# EAGLE schematic PowerSTEP01x4_002 (EAGLE 9.5.0)

## Sheet 1 of 3
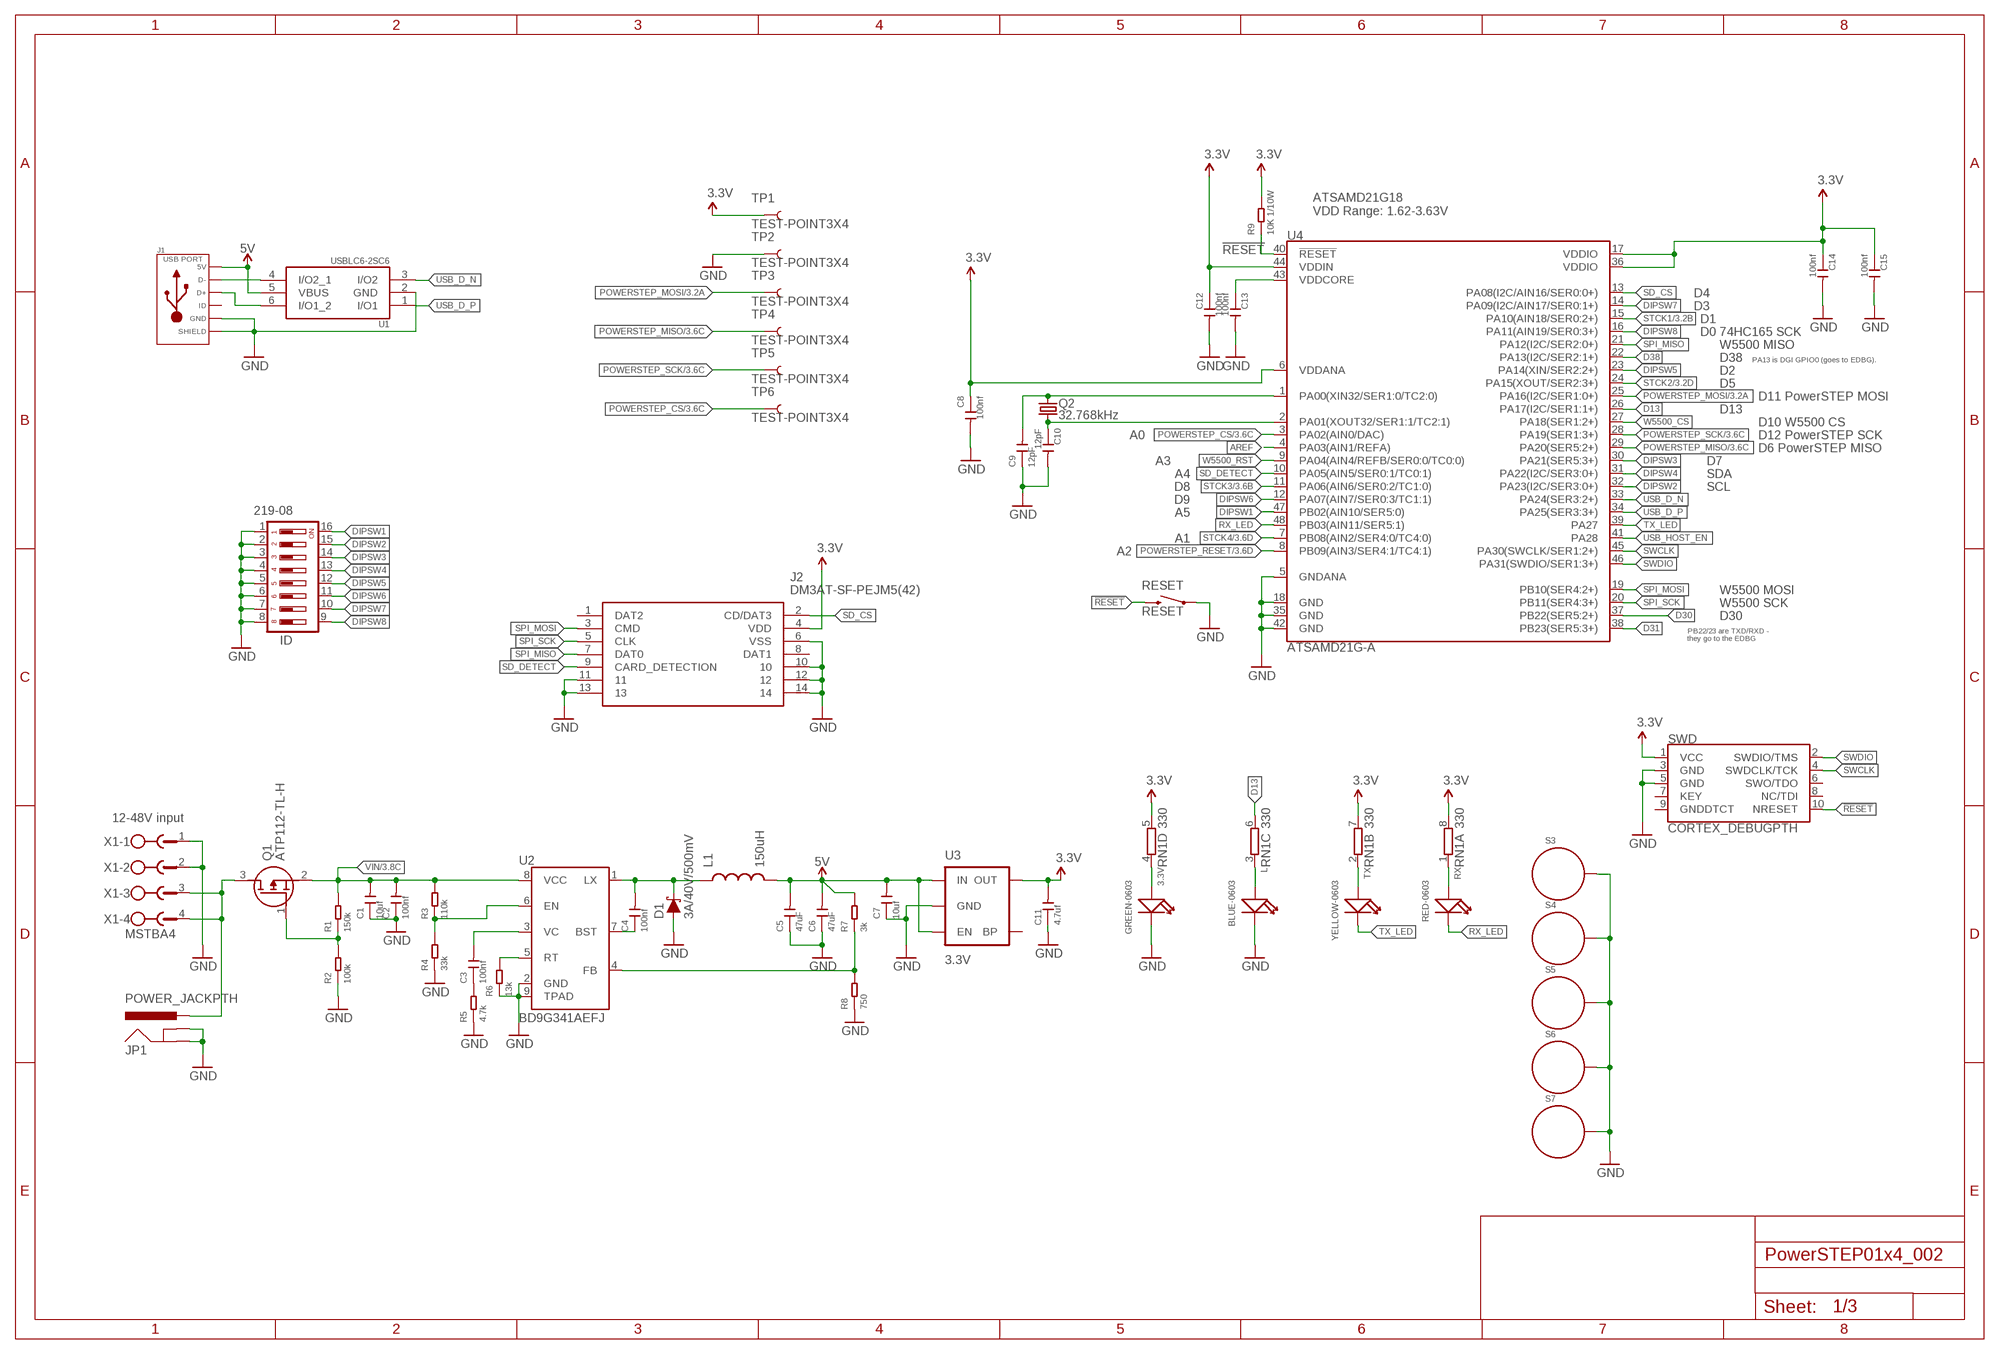
[diagram p0: schematic, sheet 1]

### Parts
3.3V  GREEN-0603  SMD-LED-CLEAR-GREEN(0603)  [LED-0603]
C1  10uf  CERAMIC-10UF-25V-10%-X5R(1206)  [C1206]
C2  100nf  CERAMIC-100NF-50V-10%-X7R(0603)  [C0603]
C3  100nf  CERAMIC-100NF-50V-10%-X7R(0603)  [C0603]
C4  100nf  CERAMIC-100NF-50V-10%-X7R(0603)  [C0603]
C5  47uF  CERAMIC-100UF-6.3V-20%-X5R(1206)  [C1206]
C6  47uF  CERAMIC-100UF-6.3V-20%-X5R(1206)  [C1206]
C7  10uf  CERAMIC-10UF-25V-10%-X5R(0805)  [C0805]
C8  100nf  CERAMIC-100NF-25V-10%-X7R(0402)  [C0402]
C9  12pF  CERAMIC-15PF-50V-5%-NPO(0402)  [C0402]
C10  12pF  CERAMIC-15PF-50V-5%-NPO(0402)  [C0402]
C11  4.7uf  CERAMIC-4.7UF-10V-10%-X5R(0603)  [C0603]
C12  100nf  CERAMIC-100NF-25V-10%-X7R(0402)  [C0402]
C13  100nf  CERAMIC-100NF-25V-10%-X7R(0402)  [C0402]
C14  100nf  CERAMIC-100NF-25V-10%-X7R(0402)  [C0402]
C15  100nf  CERAMIC-100NF-25V-10%-X7R(0402)  [C0402]
D1  3A/40V/500mV  DIODE-SCHOTTKY-B340A  [SMA-DIODE]
ID  219-08  [CTS-219-08]
J1  USB_MICRO_10118193-0001LF  [MICROUSB-FCI-PBAN]
J2  DM3AT-SF-PEJM5(42)  [DM3ATSFPEJM542]
JP1  POWER_JACKPTH  [POWER_JACK_PTH]
L  BLUE-0603  SMD-LED-CLEAR-BLUE(0603)  [LED-0603]
L1  150uH  L5045  [L5045_L]
Q1  ATP112-TL-H  [ATP112TLH]
Q2  32.768kHz  CRYSTALFC-135  [FC-135]
R1  150k  SMD-RES-100K-1%-1/10W(0603)  [R0603]
R2  100k  SMD-RES-100K-1%-1/10W(0603)  [R0603]
R3  110k  SMD-RES-100K-1%-1/10W(0603)  [R0603]
R4  33k  SMD-RES-100K-1%-1/10W(0603)  [R0603]
R5  4.7k  SMD-RES-100K-1%-1/10W(0603)  [R0603]
R6  13k  SMD-RES-100K-1%-1/10W(0603)  [R0603]
R7  3k  SMD-RES-100K-1%-1/10W(0603)  [R0603]
R8  750  SMD-RES-100K-1%-1/10W(0603)  [R0603]
R9  10K 1/10W  SMD-RES-10K-5%-1/10W(0603)  [R0603]
RESET  RESET  SWITCH-MOMENTARY-2SMD  [TACTILE-SWITCH-SMD]
RN1  330  4R-NCAY16_LONG_W  [CAY16_LONG_W]
RX  RED-0603  LED-SMD-RED-DIFFUSED(0603)  [LED-0603]
S3  STANDOFF_ELECTRICAL  [STANDOFF-ELECTRICAL]
S4  STANDOFF_ELECTRICAL  [STANDOFF-ELECTRICAL]
S5  STANDOFF_ELECTRICAL  [STANDOFF-ELECTRICAL]
S6  STANDOFF_ELECTRICAL  [STANDOFF-ELECTRICAL]
S7  STANDOFF_ELECTRICAL  [STANDOFF-ELECTRICAL]
SWD  CORTEX_DEBUGPTH  [2X5-PTH-1.27MM]
TP1  TEST-POINT3X4  [PAD.03X.04]
TP2  TEST-POINT3X4  [PAD.03X.04]
TP3  TEST-POINT3X4  [PAD.03X.04]
TP4  TEST-POINT3X4  [PAD.03X.04]
TP5  TEST-POINT3X4  [PAD.03X.04]
TP6  TEST-POINT3X4  [PAD.03X.04]
TX  YELLOW-0603  SMD-LED-CLEAR-YELLOW(0603)  [LED-0603]
U1  USBLC6-2SC6  [SOT23-6L]
U2  BD9G341AEFJ  [SOIC127P600X100-9N]
U3  3.3V  V_REG_LDOSMD  [SOT23-5]
U4  ATSAMD21G-A  [TQFP-48]
X1  MSTBA4  [MSTBA4]

### Nets
3.3V [GND_]: C8.1 C11.2 C12.1 C14.1 C15.1 J2.4(VDD) R9.2 RN1.5 RN1.7 RN1.8 SWD.1(VCC) TP1.P$1 U3.5(OUT) U4.6(VDDANA) U4.17(VDDIO) U4.36(VDDIO) U4.44(VDDIN) ; also sheet 2,3
5V: C5.2 C6.2 C7.2 J1.1(5V) L1.P$2 R7.2 U1.5(VBUS) U3.1(IN) U3.3(EN) ; also sheet 3
!RESET: R9.1 RESET.3 SWD.10(NRESET) U4.40(!RESET!)
AREF: U4.4(PA03(AIN1/REFA))
D13: RN1.6 U4.26(PA17(I2C/SER1:1+))
D30: U4.37(PB22(SER5:2+))
D31: U4.38(PB23(SER5:3+))
D38: U4.22(PA13(I2C/SER2:1+))
D+: J1.3(D+) U1.6(I/O1_2)
DIPSW1: ID.16 U4.47(PB02(AIN10/SER5:0))
DIPSW2: ID.15 U4.32(PA23(I2C/SER3:0+))
DIPSW3: ID.14 U4.30(PA21(SER5:3+))
DIPSW4: ID.13 U4.31(PA22(I2C/SER3:0+))
DIPSW5: ID.12 U4.23(PA14(XIN/SER2:2+))
DIPSW6: ID.11 U4.12(PA07(AIN7/SER0:3/TC1:1))
DIPSW7: ID.10 U4.14(PA09(I2C/AIN17/SER0:1+))
DIPSW8: ID.9 U4.16(PA11(AIN19/SER0:3+))
GND: 3.3V.- C1.1 C2.1 C5.1 C6.1 C7.1 C8.2 C9.1 C10.2 C11.1 C12.2 C13.2 C14.2 C15.2 D1.A ID.1 ID.2 ID.3 ID.4 ID.5 ID.6 ID.7 ID.8 J1.5(GND) J1.S1(SLD) J1.S2(SLD) J1.S3(SLD) J1.S4(SLD) J1.S5(SLD) J1.S6(SLD) J1.S7(SLD) J1.S8(SLD) J2.6(VSS) J2.10 J2.11 J2.12 J2.13 J2.14 JP1.GND JP1.GNDBREAK L.- R2.1 R4.1 R5.1 R6.1 R8.1 RESET.1 S3.P1 S4.P1 S5.P1 S6.P1 S7.P1 SWD.3(GND) SWD.5(GND) TP2.P$1 U1.2(GND) U2.2(GND) U2.9(TPAD) U3.2(GND) U4.5(GNDANA) U4.18(GND) U4.35(GND) U4.42(GND) X1.1 X1.2 ; also sheet 2,3
N$2: C9.2 Q2.P$2 U4.1(PA00(XIN32/SER1:0/TC2:0))
N$3: C3.1 R5.2
N$4: C10.1 Q2.P$1 U4.2(PA01(XOUT32/SER1:1/TC2:1))
N$5: RN1.1 RX.+
N$6: RN1.2 TX.+
N$7: R7.1 R8.2 U2.4(FB)
N$8: R3.1 R4.2 U2.6(EN)
N$9: R6.2 U2.5(RT)
N$10: L.+ RN1.3
N$11: 3.3V.+ RN1.4
N$12: C3.2 U2.3(VC)
N$15: C4.1 U2.7(BST)
N$17: C4.2 D1.C L1.P$1 U2.1(LX)
N$20: Q1.1(G) R1.1 R2.2
N$49: J1.2(D-) U1.4(I/O2_1)
POWERSTEP_CS: TP6.P$1 U4.3(PA02(AIN0/DAC)) ; also sheet 3
POWERSTEP_MISO: TP4.P$1 U4.29(PA20(SER5:2+)) ; also sheet 3
POWERSTEP_MOSI: TP3.P$1 U4.25(PA16(I2C/SER1:0+)) ; also sheet 3
POWERSTEP_RESET: U4.8(PB09(AIN3/SER4:1/TC4:1)) ; also sheet 3
POWERSTEP_SCK: TP5.P$1 U4.28(PA19(SER1:3+)) ; also sheet 3
RX_LED: RX.- U4.48(PB03(AIN11/SER5:1))
SD_CS: J2.2(CD/DAT3) U4.13(PA08(I2C/AIN16/SER0:0+))
SD_DETECT: J2.9(CARD_DETECTION) U4.10(PA05(AIN5/SER0:1/TC0:1))
SPI_MISO: J2.7(DAT0) U4.21(PA12(I2C/SER2:0+)) ; also sheet 2
SPI_MOSI: J2.3(CMD) U4.19(PB10(SER4:2+)) ; also sheet 2
SPI_SCK: J2.5(CLK) U4.20(PB11(SER4:3+)) ; also sheet 2
STCK1: U4.15(PA10(AIN18/SER0:2+)) ; also sheet 3
STCK2: U4.24(PA15(XOUT/SER2:3+)) ; also sheet 3
STCK3: U4.11(PA06(AIN6/SER0:2/TC1:0)) ; also sheet 3
STCK4: U4.7(PB08(AIN2/SER4:0/TC4:0)) ; also sheet 3
SWCLK: SWD.4(SWDCLK/TCK) U4.45(PA30(SWCLK/SER1:2+))
SWDIO: SWD.2(SWDIO/TMS) U4.46(PA31(SWDIO/SER1:3+))
TX_LED: TX.- U4.39(PA27)
USB_D_N: U1.3(I/O2) U4.33(PA24(SER3:2+))
USB_D_P: U1.1(I/O1) U4.34(PA25(SER3:3+))
USB_HOST_EN: U4.41(PA28)
VDDCORE: C13.1 U4.43(VDDCORE)
VIN: C1.2 C2.2 Q1.2(S) R1.2 R3.2 U2.8(VCC) ; also sheet 3
VRAW: JP1.PWR Q1.3(D) X1.3 X1.4
W5500_CS: U4.27(PA18(SER1:2+)) ; also sheet 2
W5500_RST: U4.9(PA04(AIN4/REFB/SER0:0/TC0:0)) ; also sheet 2
Unconnected: J1.4(ID) J2.1(DAT2) J2.8(DAT1) SWD.6(SWO/TDO) SWD.7(KEY) SWD.8(NC/TDI) SWD.9(GNDDTCT) U3.4(BP)

### Notes on the sheet
- ATSAMD21G18
  VDD Range: 1.62-3.63V
- D4
- D3
- D1
- D0 74HC165 SCK
- W5500 MISO
- D38 | PA13 is DGI GPIO0 (goes to EDBG).
- D2
- D5
- D11 PowerSTEP MOSI
- D13
- D10 W5500 CS
- A0 | D12 PowerSTEP SCK
- D6 PowerSTEP MISO
- A3 | D7
- A4 | SDA
- D8 | SCL
- D9
- A5
- A1
- A2
- W5500 MOSI
- W5500 SCK
- D30
- PB22/23 are TXD/RXD - 
  they go to the EDBG
- 12-48V input

## Sheet 2 of 3
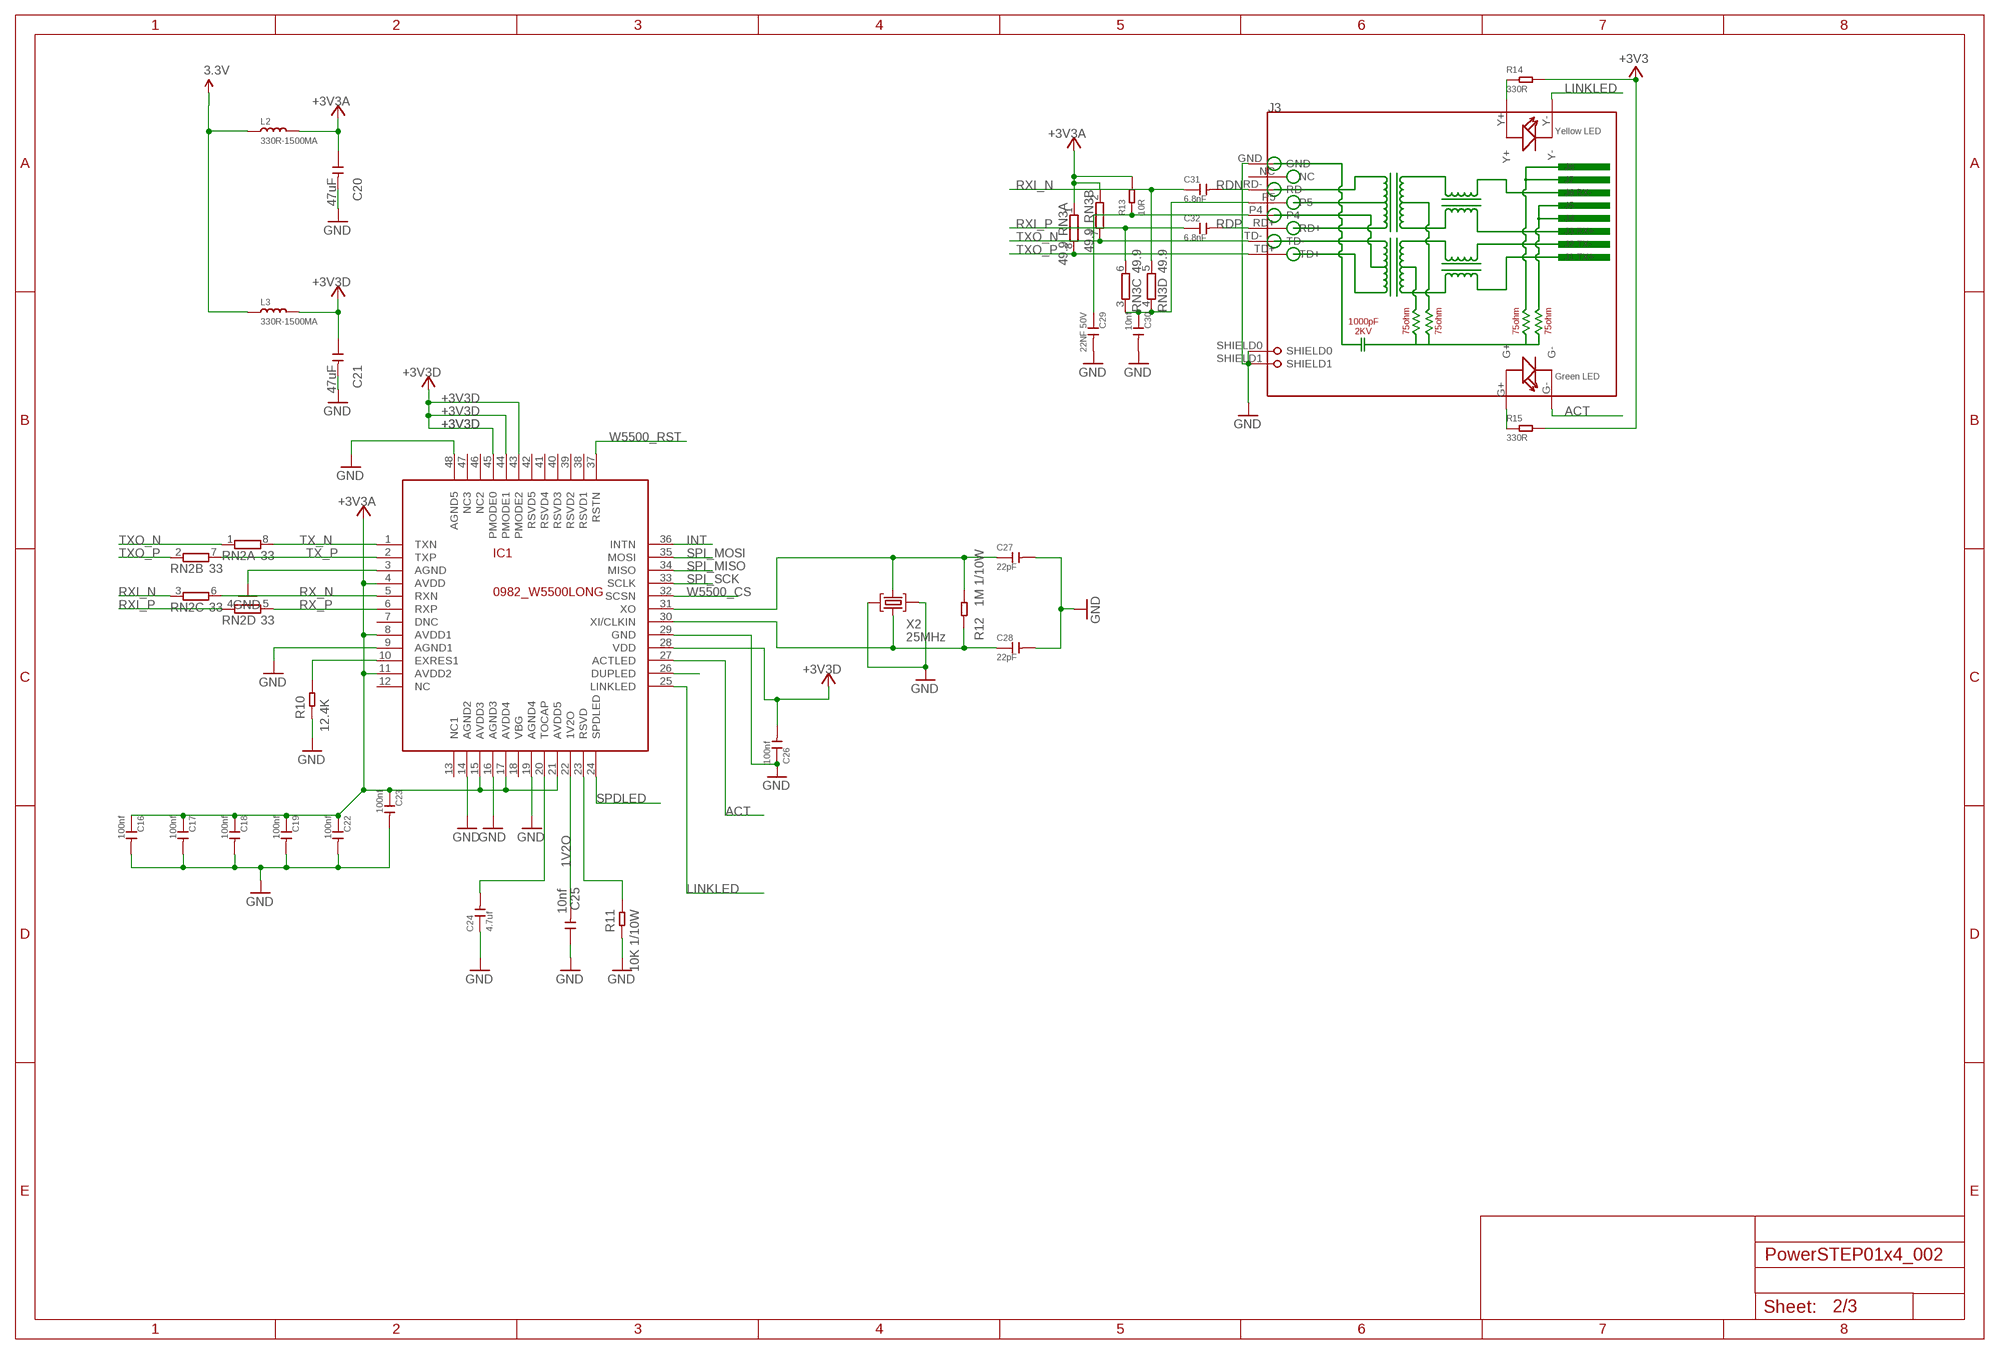
[diagram p1: schematic, sheet 2]

### Parts
C16  100nf  CERAMIC-100NF-25V-10%-X7R(0402)  [C0402]
C17  100nf  CERAMIC-100NF-25V-10%-X7R(0402)  [C0402]
C18  100nf  CERAMIC-100NF-25V-10%-X7R(0402)  [C0402]
C19  100nf  CERAMIC-100NF-25V-10%-X7R(0402)  [C0402]
C20  47uF  CERAMIC-100UF-6.3V-20%-X5R(1206)  [C1206]
C21  47uF  CERAMIC-100UF-6.3V-20%-X5R(1206)  [C1206]
C22  100nf  CERAMIC-100NF-25V-10%-X7R(0402)  [C0402]
C23  100nf  CERAMIC-100NF-25V-10%-X7R(0402)  [C0402]
C24  4.7uf  CERAMIC-4.7UF-10V-10%-X5R(0603)  [C0603]
C25  10nf  CERAMIC-10NF-50V-10%-X7R(0402)  [C0402]
C26  100nf  CERAMIC-100NF-25V-10%-X7R(0402)  [C0402]
C27  22pF  CERAMIC-15PF-50V-5%-NPO(0402)  [C0402]
C28  22pF  CERAMIC-15PF-50V-5%-NPO(0402)  [C0402]
C29  22NF 50V  CERAMIC-22NF-50V-10%-X7R(0402)  [C0402]
C30  10nf  CERAMIC-10NF-50V-10%-X7R(0402)  [C0402]
C31  6.8nF  CERAMIC-4.7NF-50V-10%-X7R(0402)  [C0402]
C32  6.8nF  CERAMIC-4.7NF-50V-10%-X7R(0402)  [C0402]
IC1  0982_W5500LONG  [TQFP48-LONG]
J3  RJ45-HR911105A-HR911105A  [RJ45]
L2  330R-1500MA  SMD-FERRITE-BEAD-330R-1500MA(0805)'0805'  [L0805]
L3  330R-1500MA  SMD-FERRITE-BEAD-330R-1500MA(0805)'0805'  [L0805]
R10  12.4K  SMD-RES-12K-1%-1/10W(0603)  [R0603]
R11  10K 1/10W  SMD-RES-10K-5%-1/10W(0603)  [R0603]
R12  1M 1/10W  SMD-RES-1M-5%-1/10W(0603)  [R0603]
R13  10R  SMD-RES-10R-5%-1/10W(0603)  [R0603]
R14  330R  SMD-RES-330R-1%-1/10W(0603)  [R0603]
R15  330R  SMD-RES-330R-1%-1/10W(0603)  [R0603]
RN2  33  4R-NCAY16_LONG_W  [CAY16_LONG_W]
RN3  49.9  4R-NCAY16_LONG_W  [CAY16_LONG_W]
X2  25MHz  CRYSTAL-3.2-2.5  [CRYSTAL-3.2-2.5]

### Nets
1V2O: C25.2 IC1.22(1V2O)
3.3V [GND_]: L2.1 L3.1 R14.2 R15.2 ; supply symbol labelled +3V3 ; also sheet 1,3
+3V3A [POWER_]: C16.1 C17.1 C18.1 C19.1 C20.1 C22.1 C23.1 IC1.4(AVDD) IC1.8(AVDD1) IC1.11(AVDD2) IC1.15(AVDD3) IC1.17(AVDD4) IC1.21(AVDD5) L2.2 R13.2 RN3.1 RN3.2
+3V3D: C21.1 C26.2 IC1.28(VDD) IC1.43(PMODE2) IC1.44(PMODE1) IC1.45(PMODE0) L3.2
ACT: IC1.27(ACTLED) J3.G-
FDXLED: IC1.26(DUPLED)
GND: C16.2 C17.2 C18.2 C19.2 C20.2 C21.2 C22.2 C23.2 C24.1 C25.1 C26.1 C27.2 C28.2 C29.2 C30.2 IC1.3(AGND) IC1.9(AGND1) IC1.14(AGND2) IC1.16(AGND3) IC1.19(AGND4) IC1.29(GND) IC1.48(AGND5) J3.GND J3.SHIELD0 J3.SHIELD1 R10.1 R11.1 X2.2(GND) X2.4(GND) ; also sheet 1,3
INT: IC1.36(INTN)
LINKLED: IC1.25(LINKLED) J3.Y-
N$13: C27.1 IC1.31(XO) R12.1 X2.3(C2)
N$19: C29.1 J3.P4 R13.1
N$21: C30.1 J3.P5 RN3.3 RN3.4
N$22: J3.Y+ R14.1
N$23: J3.G+ R15.1
N$24: IC1.23(RSVD) R11.2
N$38: C24.2 IC1.20(TOCAP)
N$40: IC1.10(EXRES1) R10.2
OSC2E2: C28.1 IC1.30(XI/CLKIN) R12.2 X2.1(C1)
RDN: C31.2 J3.RD-
RDP: C32.2 J3.RD+
RX_N: IC1.5(RXN) RN2.6
RX_P: IC1.6(RXP) RN2.5
RXI_N: C31.1 RN2.3 RN3.5
RXI_P: C32.1 RN2.4 RN3.6
SPDLED: IC1.24(SPDLED)
SPI_MISO: IC1.34(MISO) ; also sheet 1
SPI_MOSI: IC1.35(MOSI) ; also sheet 1
SPI_SCK: IC1.33(SCLK) ; also sheet 1
TX_N: IC1.1(TXN) RN2.8
TX_P: IC1.2(TXP) RN2.7
TXO_N: J3.TD- RN2.1 RN3.7
TXO_P: J3.TD+ RN2.2 RN3.8
W5500_CS: IC1.32(SCSN) ; also sheet 1
W5500_RST: IC1.37(RSTN) ; also sheet 1
Unconnected: IC1.7(DNC) IC1.13(NC1) IC1.18(VBG) IC1.41(RSVD4) IC1.42(RSVD5) IC1.46(NC2) IC1.47(NC3) J3.NC

## Sheet 3 of 3
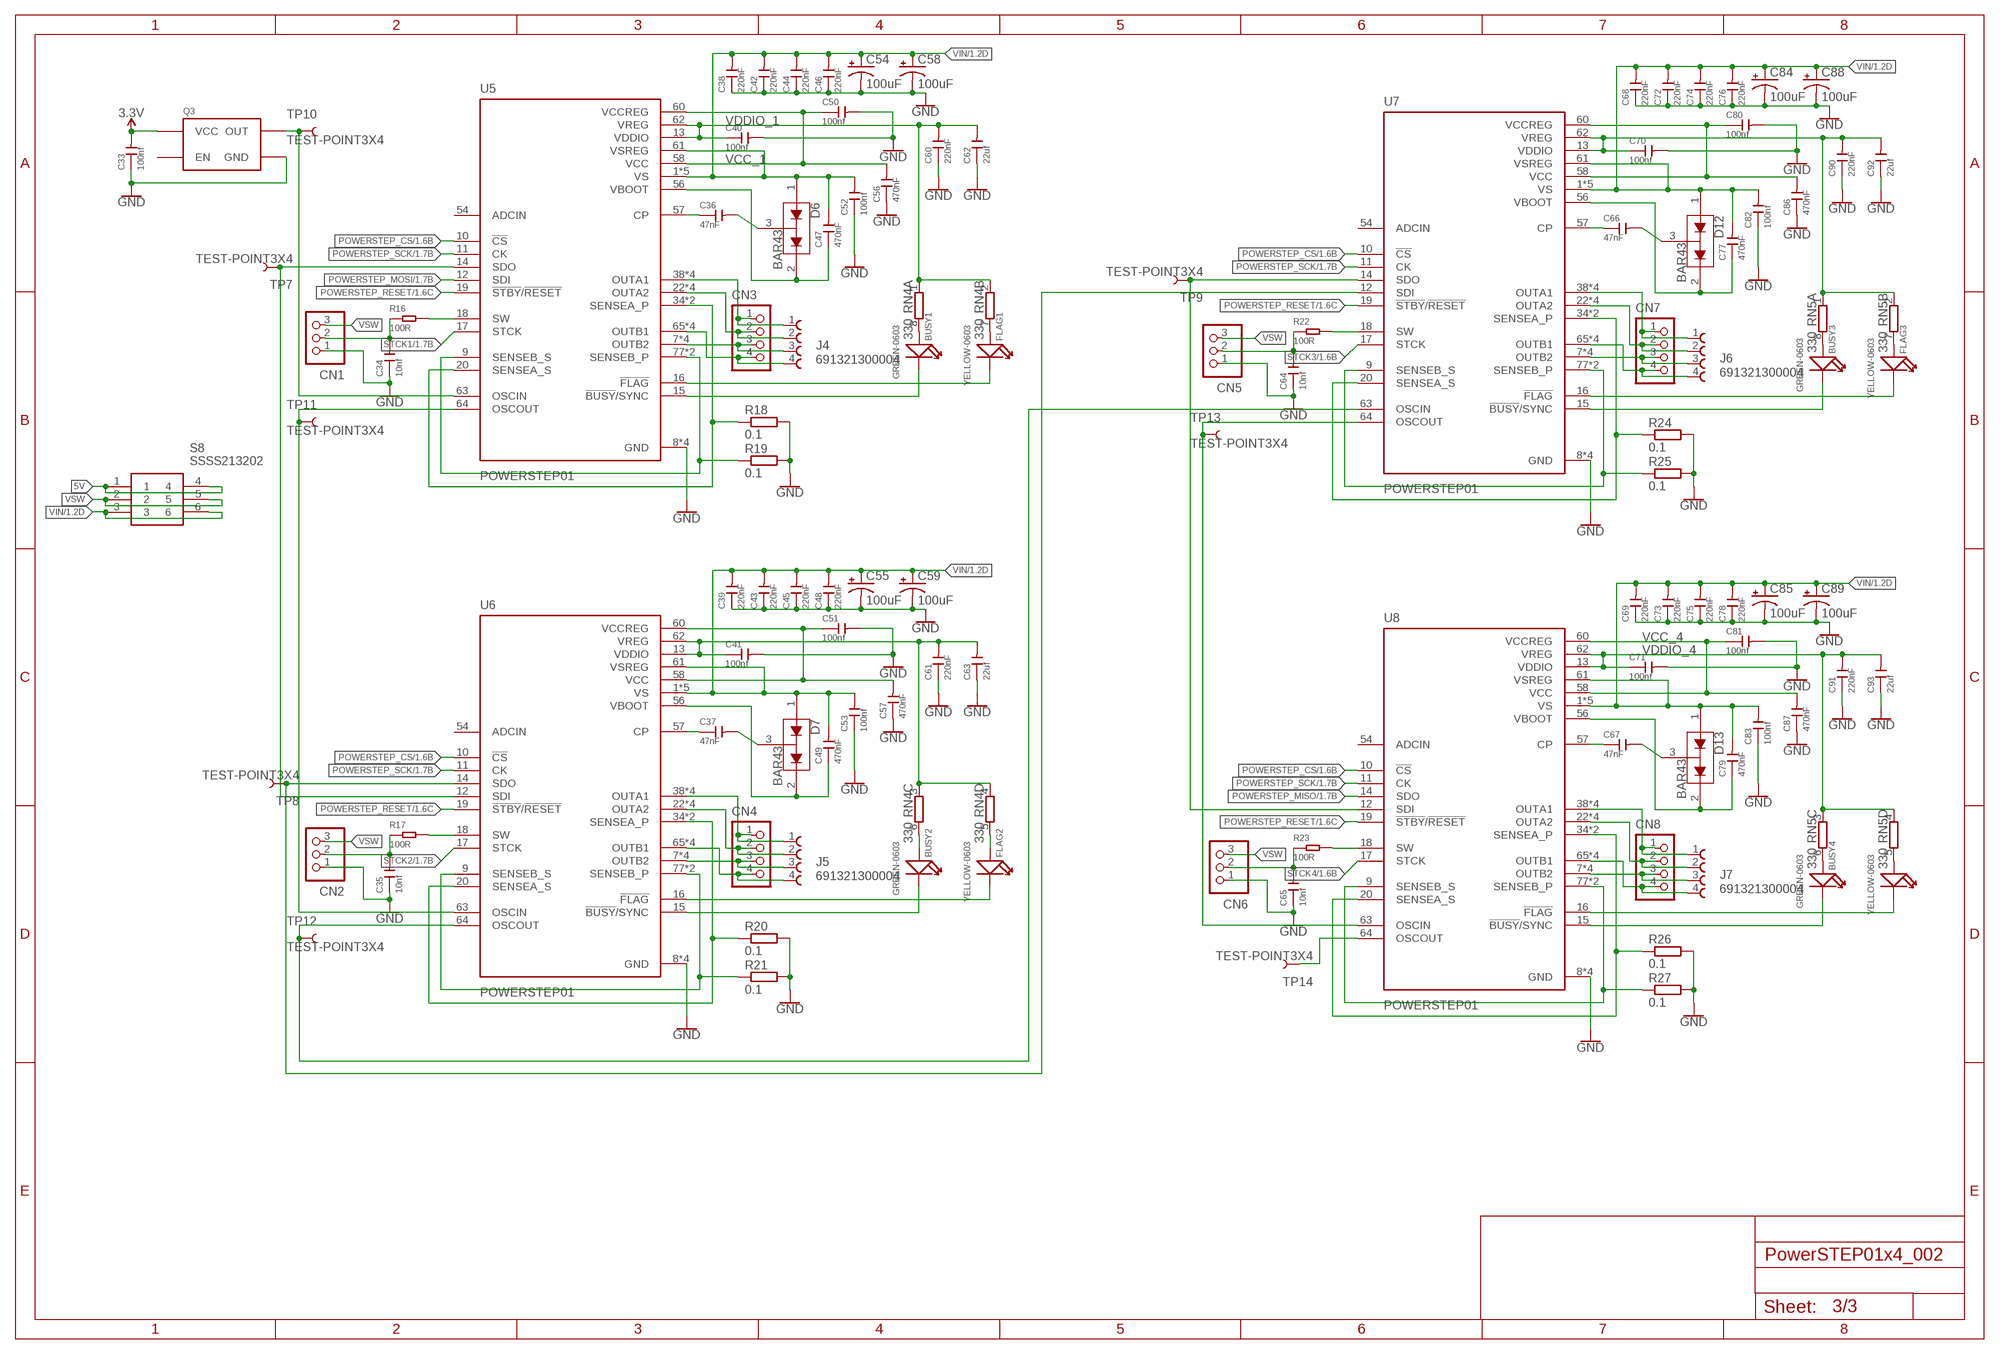
[diagram p2: schematic, sheet 3]

### Parts
BUSY1  GREEN-0603  SMD-LED-CLEAR-GREEN(0603)  [LED-0603]
BUSY2  GREEN-0603  SMD-LED-CLEAR-GREEN(0603)  [LED-0603]
BUSY3  GREEN-0603  SMD-LED-CLEAR-GREEN(0603)  [LED-0603]
BUSY4  GREEN-0603  SMD-LED-CLEAR-GREEN(0603)  [LED-0603]
C33  100nf  CERAMIC-100NF-25V-10%-X7R(0402)  [C0402]
C34  10nf  CERAMIC-10NF-50V-10%-X7R(0402)  [C0402]
C35  10nf  CERAMIC-10NF-50V-10%-X7R(0402)  [C0402]
C36  47nF  CERAMIC-22PF-50V-5%-NPO(0603)  [C0603]
C37  47nF  CERAMIC-22PF-50V-5%-NPO(0603)  [C0603]
C38  220nF  CERAMIC-22UF-6.3V-20%-X5R(0805)  [C0805]
C39  220nF  CERAMIC-22UF-6.3V-20%-X5R(0805)  [C0805]
C40  100nf  CERAMIC-100NF-25V-10%-X7R(0402)  [C0402]
C41  100nf  CERAMIC-100NF-25V-10%-X7R(0402)  [C0402]
C42  220nF  CERAMIC-22UF-6.3V-20%-X5R(0805)  [C0805]
C43  220nF  CERAMIC-22UF-6.3V-20%-X5R(0805)  [C0805]
C44  220nF  CERAMIC-22UF-6.3V-20%-X5R(0805)  [C0805]
C45  220nF  CERAMIC-22UF-6.3V-20%-X5R(0805)  [C0805]
C46  220nF  CERAMIC-22UF-6.3V-20%-X5R(0805)  [C0805]
C47  470nF  CERAMIC-100PF-50V-5%-NPO(0603)  [C0603]
C48  220nF  CERAMIC-22UF-6.3V-20%-X5R(0805)  [C0805]
C49  470nF  CERAMIC-100PF-50V-5%-NPO(0603)  [C0603]
C50  100nf  CERAMIC-100NF-25V-10%-X7R(0402)  [C0402]
C51  100nf  CERAMIC-100NF-25V-10%-X7R(0402)  [C0402]
C52  100nf  CERAMIC-100NF-50V-10%-X7R(0603)  [C0603]
C53  100nf  CERAMIC-100NF-50V-10%-X7R(0603)  [C0603]
C54  100uF  C_POL_D8  [C_POL_D8]
C55  100uF  C_POL_D8  [C_POL_D8]
C56  470nF  CERAMIC-220NF-25V-10%-X7R(0603)  [C0603]
C57  470nF  CERAMIC-220NF-25V-10%-X7R(0603)  [C0603]
C58  100uF  C_POL_D8  [C_POL_D8]
C59  100uF  C_POL_D8  [C_POL_D8]
C60  220nF  CERAMIC 100NF-10V-10%-X5R(0402)  [C0402]
C61  220nF  CERAMIC 100NF-10V-10%-X5R(0402)  [C0402]
C62  22uf  CERAMIC-22UF-6.3V-20%-X5R(0805)  [C0805]
C63  22uf  CERAMIC-22UF-6.3V-20%-X5R(0805)  [C0805]
C64  10nf  CERAMIC-10NF-50V-10%-X7R(0402)  [C0402]
C65  10nf  CERAMIC-10NF-50V-10%-X7R(0402)  [C0402]
C66  47nF  CERAMIC-22PF-50V-5%-NPO(0603)  [C0603]
C67  47nF  CERAMIC-22PF-50V-5%-NPO(0603)  [C0603]
C68  220nF  CERAMIC-22UF-6.3V-20%-X5R(0805)  [C0805]
C69  220nF  CERAMIC-22UF-6.3V-20%-X5R(0805)  [C0805]
C70  100nf  CERAMIC-100NF-25V-10%-X7R(0402)  [C0402]
C71  100nf  CERAMIC-100NF-25V-10%-X7R(0402)  [C0402]
C72  220nF  CERAMIC-22UF-6.3V-20%-X5R(0805)  [C0805]
C73  220nF  CERAMIC-22UF-6.3V-20%-X5R(0805)  [C0805]
C74  220nF  CERAMIC-22UF-6.3V-20%-X5R(0805)  [C0805]
C75  220nF  CERAMIC-22UF-6.3V-20%-X5R(0805)  [C0805]
C76  220nF  CERAMIC-22UF-6.3V-20%-X5R(0805)  [C0805]
C77  470nF  CERAMIC-100PF-50V-5%-NPO(0603)  [C0603]
C78  220nF  CERAMIC-22UF-6.3V-20%-X5R(0805)  [C0805]
C79  470nF  CERAMIC-100PF-50V-5%-NPO(0603)  [C0603]
C80  100nf  CERAMIC-100NF-25V-10%-X7R(0402)  [C0402]
C81  100nf  CERAMIC-100NF-25V-10%-X7R(0402)  [C0402]
C82  100nf  CERAMIC-100NF-50V-10%-X7R(0603)  [C0603]
C83  100nf  CERAMIC-100NF-50V-10%-X7R(0603)  [C0603]
C84  100uF  C_POL_D8  [C_POL_D8]
C85  100uF  C_POL_D8  [C_POL_D8]
C86  470nF  CERAMIC-220NF-25V-10%-X7R(0603)  [C0603]
C87  470nF  CERAMIC-220NF-25V-10%-X7R(0603)  [C0603]
C88  100uF  C_POL_D8  [C_POL_D8]
C89  100uF  C_POL_D8  [C_POL_D8]
C90  220nF  CERAMIC 100NF-10V-10%-X5R(0402)  [C0402]
C91  220nF  CERAMIC 100NF-10V-10%-X5R(0402)  [C0402]
C92  22uf  CERAMIC-22UF-6.3V-20%-X5R(0805)  [C0805]
C93  22uf  CERAMIC-22UF-6.3V-20%-X5R(0805)  [C0805]
CN1  B3B-XASK-1  [B3B-XASK-1]
CN2  B3B-XASK-1  [B3B-XASK-1]
CN3  B4B-XASK-1  [B4B-XASK-1]
CN4  B4B-XASK-1  [B4B-XASK-1]
CN5  B3B-XASK-1  [B3B-XASK-1]
CN6  B3B-XASK-1  [B3B-XASK-1]
CN7  B4B-XASK-1  [B4B-XASK-1]
CN8  B4B-XASK-1  [B4B-XASK-1]
D6  BAR43  BAV99  [SOT23-3]
D7  BAR43  BAV99  [SOT23-3]
D12  BAR43  BAV99  [SOT23-3]
D13  BAR43  BAV99  [SOT23-3]
FLAG1  YELLOW-0603  SMD-LED-CLEAR-YELLOW(0603)  [LED-0603]
FLAG2  YELLOW-0603  SMD-LED-CLEAR-YELLOW(0603)  [LED-0603]
FLAG3  YELLOW-0603  SMD-LED-CLEAR-YELLOW(0603)  [LED-0603]
FLAG4  YELLOW-0603  SMD-LED-CLEAR-YELLOW(0603)  [LED-0603]
J4  691321300004  [691321300004]
J5  691321300004  [691321300004]
J6  691321300004  [691321300004]
J7  691321300004  [691321300004]
Q3  CRYSTAL_OSC_SG5032  [SG5032]
R16  100R  SMD-RES-100R-5%-1/10W(0603)  [R0603]
R17  100R  SMD-RES-100R-5%-1/10W(0603)  [R0603]
R18  0.1  RESISTOR_6332  [RESC6332X71N]
R19  0.1  RESISTOR_6332  [RESC6332X71N]
R20  0.1  RESISTOR_6332  [RESC6332X71N]
R21  0.1  RESISTOR_6332  [RESC6332X71N]
R22  100R  SMD-RES-100R-5%-1/10W(0603)  [R0603]
R23  100R  SMD-RES-100R-5%-1/10W(0603)  [R0603]
R24  0.1  RESISTOR_6332  [RESC6332X71N]
R25  0.1  RESISTOR_6332  [RESC6332X71N]
R26  0.1  RESISTOR_6332  [RESC6332X71N]
R27  0.1  RESISTOR_6332  [RESC6332X71N]
RN4  330  4R-NCAY16_LONG_W  [CAY16_LONG_W]
RN5  330  4R-NCAY16_LONG_W  [CAY16_LONG_W]
S8  SSSS213202  [SSSS213202]
TP7  TEST-POINT3X4  [PAD.03X.04]
TP8  TEST-POINT3X4  [PAD.03X.04]
TP9  TEST-POINT3X4  [PAD.03X.04]
TP10  TEST-POINT3X4  [PAD.03X.04]
TP11  TEST-POINT3X4  [PAD.03X.04]
TP12  TEST-POINT3X4  [PAD.03X.04]
TP13  TEST-POINT3X4  [PAD.03X.04]
TP14  TEST-POINT3X4  [PAD.03X.04]
U5  POWERSTEP01  [IC_POWERSTEP01]
U6  POWERSTEP01  [IC_POWERSTEP01]
U7  POWERSTEP01  [IC_POWERSTEP01]
U8  POWERSTEP01  [IC_POWERSTEP01]

### Nets
3.3V [GND_]: C33.2 Q3.4(VCC) ; also sheet 1,2
5V: S8.1 S8.4 ; also sheet 1
GND: C33.1 C34.1 C35.1 C38.1 C39.1 C40.2 C41.2 C42.1 C43.1 C44.1 C45.1 C46.1 C48.1 C50.2 C51.2 C52.1 C53.1 C54.- C55.- C56.1 C57.1 C58.- C59.- C60.1 C61.1 C62.1 C63.1 C64.1 C65.1 C68.1 C69.1 C70.2 C71.2 C72.1 C73.1 C74.1 C75.1 C76.1 C78.1 C80.2 C81.2 C82.1 C83.1 C84.- C85.- C86.1 C87.1 C88.- C89.- C90.1 C91.1 C92.1 C93.1 CN1.1 CN2.1 CN5.1 CN6.1 Q3.2(GND) R18.2 R19.2 R20.2 R21.2 R24.2 R25.2 R26.2 R27.2 U5.8(GND) U5.21(GND) U5.59(GND) U5.EPAD9(GND) U6.8(GND) U6.21(GND) U6.59(GND) U6.EPAD9(GND) U7.8(GND) U7.21(GND) U7.59(GND) U7.EPAD9(GND) U8.8(GND) U8.21(GND) U8.59(GND) U8.EPAD9(GND) ; also sheet 1,2
N$1: TP14.P$1 U8.64(OSCOUT)
N$18: BUSY1.+ RN4.8
N$30: FLAG1.+ RN4.7
N$32: C36.2 D6.3(COM)
N$33: C36.1 U5.57(CP)
N$36: BUSY2.+ RN4.6
N$37: FLAG2.+ RN4.5
N$39: FLAG1.- U5.16(!FLAG)
N$41: BUSY1.- U5.15(!BUSY!/SYNC)
N$42: R19.1 U5.9(SENSEB_S) U5.77(SENSEB_P) U5.82(SENSEB_P)
N$43: R18.1 U5.20(SENSEA_S) U5.34(SENSEA_P) U5.39(SENSEA_P)
N$44: R16.2 U5.18(SW)
N$45: C34.2 CN1.2 R16.1
N$46: CN3.1 J4.1 U5.38(OUTA1) U5.42(OUTA1) U5.53(OUTA1) U5.EPAD4(OUTA1)
N$47: CN3.2 J4.2 U5.22(OUTA2) U5.33(OUTA2) U5.37(OUTA2) U5.EPAD3(OUTA2)
N$48: TP7.P$1 U5.14(SDO) U6.12(SDI)
N$51: CN3.3 J4.3 U5.7(OUTB2) U5.81(OUTB2) U5.85(OUTB2) U5.EPAD8(OUTB2)
N$52: CN3.4 J4.4 U5.65(OUTB1) U5.76(OUTB1) U5.80(OUTB1) U5.EPAD7(OUTB1)
N$53: C37.2 D7.3(COM)
N$54: C37.1 U6.57(CP)
N$56: BUSY3.+ RN5.8
N$57: FLAG3.+ RN5.7
N$58: FLAG2.- U6.16(!FLAG)
N$59: BUSY2.- U6.15(!BUSY!/SYNC)
N$61: R21.1 U6.9(SENSEB_S) U6.77(SENSEB_P) U6.82(SENSEB_P)
N$62: R20.1 U6.20(SENSEA_S) U6.34(SENSEA_P) U6.39(SENSEA_P)
N$63: R17.2 U6.18(SW)
N$64: TP12.P$1 U6.64(OSCOUT) U7.63(OSCIN)
N$65: CN4.1 J5.1 U6.38(OUTA1) U6.42(OUTA1) U6.53(OUTA1) U6.EPAD4(OUTA1)
N$66: CN4.2 J5.2 U6.22(OUTA2) U6.33(OUTA2) U6.37(OUTA2) U6.EPAD3(OUTA2)
N$67: CN4.3 J5.3 U6.7(OUTB2) U6.81(OUTB2) U6.85(OUTB2) U6.EPAD8(OUTB2)
N$68: CN4.4 J5.4 U6.65(OUTB1) U6.76(OUTB1) U6.80(OUTB1) U6.EPAD7(OUTB1)
N$69: C35.2 CN2.2 R17.1
N$70: BUSY4.+ RN5.6
N$71: C77.1 D12.2(C2) U7.56(VBOOT)
N$72: C66.2 D12.3(COM)
N$73: C66.1 U7.57(CP)
N$75: FLAG4.+ RN5.5
N$76: CN7.4 J6.4 U7.65(OUTB1) U7.76(OUTB1) U7.80(OUTB1) U7.EPAD7(OUTB1)
N$77: FLAG3.- U7.16(!FLAG)
N$78: BUSY3.- U7.15(!BUSY!/SYNC)
N$80: R25.1 U7.9(SENSEB_S) U7.77(SENSEB_P) U7.82(SENSEB_P)
N$81: R24.1 U7.20(SENSEA_S) U7.34(SENSEA_P) U7.39(SENSEA_P)
N$82: R22.2 U7.18(SW)
N$83: TP8.P$1 U6.14(SDO) U7.12(SDI)
N$84: CN7.1 J6.1 U7.38(OUTA1) U7.42(OUTA1) U7.53(OUTA1) U7.EPAD4(OUTA1)
N$85: CN7.2 J6.2 U7.22(OUTA2) U7.33(OUTA2) U7.37(OUTA2) U7.EPAD3(OUTA2)
N$86: CN7.3 J6.3 U7.7(OUTB2) U7.81(OUTB2) U7.85(OUTB2) U7.EPAD8(OUTB2)
N$87: CN8.4 J7.4 U8.65(OUTB1) U8.76(OUTB1) U8.80(OUTB1) U8.EPAD7(OUTB1)
N$88: C64.2 CN5.2 R22.1
N$89: CN8.3 J7.3 U8.7(OUTB2) U8.81(OUTB2) U8.85(OUTB2) U8.EPAD8(OUTB2)
N$90: C79.1 D13.2(C2) U8.56(VBOOT)
N$91: C67.2 D13.3(COM)
N$92: C67.1 U8.57(CP)
N$96: FLAG4.- U8.16(!FLAG)
N$97: BUSY4.- U8.15(!BUSY!/SYNC)
N$99: R27.1 U8.9(SENSEB_S) U8.77(SENSEB_P) U8.82(SENSEB_P)
N$100: R26.1 U8.20(SENSEA_S) U8.34(SENSEA_P) U8.39(SENSEA_P)
N$101: R23.2 U8.18(SW)
N$103: CN8.1 J7.1 U8.38(OUTA1) U8.42(OUTA1) U8.53(OUTA1) U8.EPAD4(OUTA1)
N$104: CN8.2 J7.2 U8.22(OUTA2) U8.33(OUTA2) U8.37(OUTA2) U8.EPAD3(OUTA2)
N$107: C65.2 CN6.2 R23.1
N$108: Q3.3(OUT) TP10.P$1 U5.63(OSCIN)
N$109: TP11.P$1 U5.64(OSCOUT) U6.63(OSCIN)
N$110: TP13.P$1 U7.64(OSCOUT) U8.63(OSCIN)
N$111: TP9.P$1 U7.14(SDO) U8.12(SDI)
POWERSTEP_CS: U5.10(!CS) U6.10(!CS) U7.10(!CS) U8.10(!CS) ; also sheet 1
POWERSTEP_MISO: U8.14(SDO) ; also sheet 1
POWERSTEP_MOSI: U5.12(SDI) ; also sheet 1
POWERSTEP_RESET: U5.19(!STBY!/!RESET) U6.19(!STBY!/!RESET) U7.19(!STBY!/!RESET) U8.19(!STBY!/!RESET) ; also sheet 1
POWERSTEP_SCK: U5.11(CK) U6.11(CK) U7.11(CK) U8.11(CK) ; also sheet 1
STCK1: U5.17(STCK) ; also sheet 1
STCK2: U6.17(STCK) ; also sheet 1
STCK3: U7.17(STCK) ; also sheet 1
STCK4: U8.17(STCK) ; also sheet 1
VBOOT_1: C47.1 D6.2(C2) U5.56(VBOOT)
VBOOT_2: C49.1 D7.2(C2) U6.56(VBOOT)
VCC_1: C50.1 C56.2 U5.58(VCC) U5.60(VCCREG)
VCC_2: C51.1 C57.2 U6.58(VCC) U6.60(VCCREG)
VCC_3: C80.1 C86.2 U7.58(VCC) U7.60(VCCREG)
VCC_4: C81.1 C87.2 U8.58(VCC) U8.60(VCCREG)
VDDIO_1: C40.1 C60.2 C62.2 RN4.1 RN4.2 U5.13(VDDIO) U5.62(VREG)
VDDIO_2: C41.1 C61.2 C63.2 RN4.3 RN4.4 U6.13(VDDIO) U6.62(VREG)
VDDIO_3: C70.1 C90.2 C92.2 RN5.1 RN5.2 U7.13(VDDIO) U7.62(VREG)
VDDIO_4: C71.1 C91.2 C93.2 RN5.3 RN5.4 U8.13(VDDIO) U8.62(VREG)
VIN: C38.2 C39.2 C42.2 C43.2 C44.2 C45.2 C46.2 C47.2 C48.2 C49.2 C52.2 C53.2 C54.+ C55.+ C58.+ C59.+ C68.2 C69.2 C72.2 C73.2 C74.2 C75.2 C76.2 C77.2 C78.2 C79.2 C82.2 C83.2 C84.+ C85.+ C88.+ C89.+ D6.1(A1) D7.1(A1) D12.1(A1) D13.1(A1) S8.3 S8.6 U5.1(VS) U5.23(VS) U5.43(VS) U5.55(VS) U5.61(VSREG) U5.66(VS) U6.1(VS) U6.23(VS) U6.43(VS) U6.55(VS) U6.61(VSREG) U6.66(VS) U7.1(VS) U7.23(VS) U7.43(VS) U7.55(VS) U7.61(VSREG) U7.66(VS) U8.1(VS) U8.23(VS) U8.43(VS) U8.55(VS) U8.61(VSREG) U8.66(VS) ; also sheet 1
VSW: CN1.3 CN2.3 CN5.3 CN6.3 S8.2 S8.5
Unconnected: Q3.1(EN) U5.54(ADCIN) U6.54(ADCIN) U7.54(ADCIN) U8.54(ADCIN)

## Power pins joined to a net without a drawn wire
NC: IC1.12(NC)
RSVD1: IC1.38(RSVD1)
RSVD2: IC1.39(RSVD2)
RSVD3: IC1.40(RSVD3)

## Library data of the parts
3.3V BUSY1-BUSY4 = Seeed-LED:SMD-LED-CLEAR-GREEN(0603): 304090043; MPN: 19-217-G7C-AN1P2-3T
C1 = Seeed-Capacitor:CERAMIC-10UF-25V-10%-X5R(1206): 302010181; MPN: CC1206KKX5R8BB106
C2-C4 C52 C53 C82 C83 = Seeed-Capacitor:CERAMIC-100NF-50V-10%-X7R(0603): 302010138; MPN: CC0603KRX7R9BB104
C5 C6 C20 C21 = Seeed-Capacitor:CERAMIC-100UF-6.3V-20%-X5R(1206): 302010183; MPN: GRM31CR60J107ME39L; VALUE: 100uf
C7 = Seeed-Capacitor:CERAMIC-10UF-25V-10%-X5R(0805): 302010178; MPN: CC0805KKX5R8BB106
C8 C12-C19 C22 C23 C26 C33 C40 C41 C50 C51 C70 C71 C80 C81 = Seeed-Capacitor:CERAMIC-100NF-25V-10%-X7R(0402): 302010024; MPN: CC0402KRX7R8BB104
C9 C10 C27 C28 = Seeed-Capacitor:CERAMIC-15PF-50V-5%-NPO(0402): 302010041; MPN: GRM1555C1H150JA01D; VALUE: 15pf
C11 C24 = Seeed-Capacitor:CERAMIC-4.7UF-10V-10%-X5R(0603): 302010111; MPN: CC0603KRX5R6BB475
C25 C30 C34 C35 C64 C65 = Seeed-Capacitor:CERAMIC-10NF-50V-10%-X7R(0402): 302010006; MPN: CC0402KRX7R9BB103
C29 = Seeed-Capacitor:CERAMIC-22NF-50V-10%-X7R(0402): 302010242; MPN: CC0402KRX7R9BB223
C31 C32 = Seeed-Capacitor:CERAMIC-4.7NF-50V-10%-X7R(0402): 302010261; MPN: CC0402KRX7R9BB472; VALUE: 4.7NF 50V
C36 C37 C66 C67 = Seeed-Capacitor:CERAMIC-22PF-50V-5%-NPO(0603): 302010143; MPN: CC0603JRNPO9BN220; VALUE: 22pf
C38 C39 C42-C46 C48 C68 C69 C72-C76 C78 = Seeed-Capacitor:CERAMIC-22UF-6.3V-20%-X5R(0805): 302010171; MPN: CC0805MKX5R5BB226; VALUE: 22uf
C47 C49 C77 C79 = Seeed-Capacitor:CERAMIC-100PF-50V-5%-NPO(0603): 302010076; MPN: CC0603JRNPO9BN101; VALUE: 100pf
C54 C55 C58 C59 C84 C85 C88 C89 = _kantaParts:C_POL: Nippon Chemi-Con 3300uF/50V KMH50VSSN3300M P-01590 <http://akizukidenshi.com/catalog/g/gP-01590/>
C56 C57 C86 C87 = Seeed-Capacitor:CERAMIC-220NF-25V-10%-X7R(0603): 302010073; MPN: CC0603KRX7R8BB224; VALUE: 220nf
C60 C61 C90 C91 = Seeed-Capacitor:CERAMIC 100NF-10V-10%-X5R(0402): 302010037; MPN: CC0402KRX5R6BB104; VALUE: 100NF 10V
C62 C63 C92 C93 = Seeed-Capacitor:CERAMIC-22UF-6.3V-20%-X5R(0805): 302010171; MPN: CC0805MKX5R5BB226
CN1 CN2 CN5 CN6 = jst-xa:B3B-XASK-1: Wire-to-Board 2.5mm pitch top mount connector Source: http://www.jst-mfg.com/product/pdf/jpn/XA1.pdf http://www.jst-mfg.com/product/detail.php?series=272
CN3 CN4 CN7 CN8 = jst-xa:B4B-XASK-1: Wire-to-Board 2.5mm pitch top mount connector Source: http://www.jst-mfg.com/product/pdf/jpn/XA1.pdf http://www.jst-mfg.com/product/detail.php?series=272
D1 = SparkFun-DiscreteSemi:DIODE-SCHOTTKY: Schottky diode A Schottky diode is a semiconductor diode which has a low forward voltage drop and a very fast switching action.; PROD_ID: DIO-09886
D6 D7 D12 D13 = SparkFun-DiscreteSemi:BAV99: Series-pair diode array Two small signal silicon diodes connected anode to cathode. Connections to all three nodes available. Link to datasheet <https://www.fairchildsemi.com/datasheets/BA/BAV99.pdf> SparkFun Products: SparkFun AutoDriver <https://www.sparkfun.com/products/13752>; PROD_ID: DIO-10647; VALUE: 200mA/70V
FLAG1-FLAG4 TX = Seeed-LED:SMD-LED-CLEAR-YELLOW(0603): 304090044; MPN: 19-217-Y5C-AM1N1VY-3T
IC1 = _kantaParts:0982_W5500: The W5500 chip is a Hardwired TCP/IP embedded Ethernet controller that enables easier internet connection for embedded systems using SPI (Serial Peripheral Interface). Case TQFP48
ID = switch-dil:219-08*: Surface Mount DIP Switch Series 219 SMT CTS Electronic Components Sourc: www.ctscorp.com; OC_FARNELL: unknown; OC_NEWARK: unknown
J1 = _kantaParts:USB: Library: MF_Connectors Description: 5 Pin USB Connectors. SLD is the shield connection. Usually tied to ground through a small ferrite bead.
J2 = SamacSys_Parts:DM3AT-SF-PEJM5(42): Memory Card Connectors SD R/A PUSH-PUSH SMD CONN MICRO Source: Datasheet <https://www.hirose.com/product/document?clcode=CL0609-0031-0-00&productname=DM3AT-SF-PEJM5&series=DM3&documenttype=2DDrawing&lang=en&documentid=0000947170>; DESCRIPTION: Memory Card Connectors SD R/A PUSH-PUSH SMD CONN MICRO; HEIGHT: 1.83mm; MANUFACTURER_NAME: Hirose; MANUFACTURER_PART_NUMBER: DM3AT-SF-PEJM5(42); MOUSER_PART_NUMBER: 798-DM3AT-SF-PEJM542; MOUSER_PRICE-STOCK: https://www.mouser.com/Search/Refine.aspx?Keyword=798-DM3AT-SF-PEJM542
J3 = Connector:RJ45-HR911105A
J4-J7 = 691321300004:691321300004: WR-TBL Serie 321 - 3.81mm Vertical PCB Header , 4 Pins=>Code : Con_TBL_Pluggable_3.81_PCB_THT_Simple_691321300004 <http://katalog.we-online.de/media/images/eican/Con_TBL_Pluggable_3.81_PCB_THT_Simple_6913213000xx_pf2.jpg> Details see: http://katalog.we-online.de/en/em/TBL_3_81_321_VERTICAL_PCB_HEADER_6913213000XX Created 2014-06-19, Karrer Zheng 2014 (C) Würth Elektronik; AVAILABILITY: Unavailable; DESCRIPTION: 321; 3.81mm Pitch Straight Pluggable Term Block, PCB Header, Through Hole, 4 Way; MF: Wurth Electronics; MP: 691321300004; PACKAGE: None; PRICE: None
JP1 = SparkFun-Connectors:POWER_JACK: Power Jack This is the standard 5.5mm barrel jack for power. The PTH is the most common, proven, reliable, footprint. The Slot footprint only works if the mill layer is transmitted to the PCB fab house so be warned. Mating wall wart : TOL-00298 (and others); PROD_ID: CONN-08197
L = Seeed-LED:SMD-LED-CLEAR-BLUE(0603): 304090045; MPN: 19-217-BHC-ZL1M2RY-3T
L1 = _kantaParts:L: L 5045 : TDK VLS5045EX, Bourns SRN5040 2012 : Bourns MH2029-300Y <http://www.mouser.jp/ProductDetail/Bourns/MH2029-300Y/>
L2 L3 = Seeed-Inductor:SMD-FERRITE-BEAD-330R-1500MA(0805): 303030006; MPN: BLM21PG331SN1D
Q1 = ATP112-TL-H:ATP112-TL-H: ON Semiconductor ATP112-TL-H P-channel MOSFET Transistor, 25 A, -25 V, 3-Pin ATPAK Source: Datasheet <https://www.onsemi.com/pub/Collateral/ENA1754-D.PDF>; DESCRIPTION: ON Semiconductor ATP112-TL-H P-channel MOSFET Transistor, 25 A, -25 V, 3-Pin ATPAK; HEIGHT: 1.5mm; MANUFACTURER_NAME: ON Semiconductor; MANUFACTURER_PART_NUMBER: ATP112-TL-H; MOUSER_PART_NUMBER: 863-ATP112-TL-H; MOUSER_PRICE-STOCK: https://www.mouser.com/Search/Refine.aspx?Keyword=863-ATP112-TL-H; RS_PART_NUMBER: 8020752P; RS_PRICE-STOCK: http://uk.rs-online.com/web/p/products/8020752P
Q2 = _kantaParts:CRYSTAL: CRYSTAL
Q3 = _kantaParts:CRYSTAL_OSC
R1-R8 = Seeed-Resistor:SMD-RES-100K-1%-1/10W(0603): 301010196; MPN: RC0603FR-07100KL; VALUE: 100K
R9 R11 = Seeed-Resistor:SMD-RES-10K-5%-1/10W(0603): 301010293; MPN: RC0603JR-0710KL
R10 = Seeed-Resistor:SMD-RES-12K-1%-1/10W(0603): 301010102; MPN: RC0603FR-0712KL; VALUE: 12K
R12 = Seeed-Resistor:SMD-RES-1M-5%-1/10W(0603): 301010100; MPN: RC0603JR-071ML
R13 = Seeed-Resistor:SMD-RES-10R-5%-1/10W(0603): 301010096; MPN: RC0603JR-0710RL
R14 R15 = Seeed-Resistor:SMD-RES-330R-1%-1/10W(0603): 301010300; MPN: RC0603FR-07330RL
R16 R17 R22 R23 = Seeed-Resistor:SMD-RES-100R-5%-1/10W(0603): 301010090; MPN: RC0603JR-07100RL
R18-R21 R24-R27 = _kantaParts:RESISTOR: Resistors TAKMAN RWBS/RSBS series http://www.takman-e.co.jp/pdf/rwb_rsb.pdf
RESET = SparkFun-Electromechanical:SWITCH-MOMENTARY-2: Various NO switches- pushbuttons, reed, etc; PROD_ID: SWCH-08247
RN1-RN5 = _kantaParts:4R-N: Array Chip Resistor Source: RS Component / Phycomp
RX = Seeed-LED:LED-SMD-RED-DIFFUSED(0603): 304090042; MPN: 19-217-R6C-AL1M2VY-3T
S3-S7 = SparkFun-Electromechanical:STANDOFF_ELECTRICAL: A standoff intended to be an electrically connected point. Pad size and stop size allow for a #4 Phillips pan screw head to make a solid connection to the board.
S8 = SamacSys_Parts:SSSS213202: Slide Switches 1-pole 2-positions Surface Mount Slide Switch SPDT Maintained 0.3 A Slide Source: Datasheet <http://uk.rs-online.com/web/p/products/1238917>; DESCRIPTION: Slide Switches 1-pole 2-positions Surface Mount Slide Switch SPDT Maintained 0.3 A Slide; HEIGHT: mm; MANUFACTURER_NAME: ALPS; MANUFACTURER_PART_NUMBER: SSSS213202; RS_PART_NUMBER: 1238917; RS_PRICE-STOCK: http://uk.rs-online.com/web/p/products/1238917
SWD = samd21-temp:CORTEX_DEBUG: Cortex Debug Connector Datasheet <http://infocenter.arm.com/help/topic/com.arm.doc.faqs/attached/13634/cortex_debug_connectors.pdf>
TP1-TP14 = SparkFun-Connectors:TEST-POINT: SparkFun Test Points Bare copper test points for troubleshooting or In-Circuit-Testing. These are used by our Production team for verifying production board runs using pogo-pins on test beds. SparkFun Products: SparkFun LSM9DS1 Breakout <https://www.sparkfun.com/products/13284> SparkFun PSOC <https://www.sparkfun.com/products/13714> SparkFun Load Cell Amplifier <https://www.sparkfun.com/products/13879>
U1 = _kantaParts:USBLC6: STMicroelectronics USBLC6 VERY LOW CAPACITANCE ESD PROTECTION RS 624-7693 <http://jp.rs-online.com/web/p/tvs/6247693/>
U2 = _kantaParts:BD9G341AEFJ
U3 = SparkFun:V_REG_LDO: Voltage Regulator LDO Standard 150mA LDO voltage regulator in SOT-23 layout. Micrel part MIC5205. BP (by-pass) pin is used to lower output noise with 470pF cap.
U4 = samd21-temp:ATSAMD21G: Atmel SAMD21G SMART ARM-Based Microcontroller The Atmel ® | SMART ™ SAM D21 is a series of low-power microcontrollers using the 32-bit ARM ® Cortex ® -M0+ processor, and ranging from 32- to 64-pins with up to 256KB Flash and 32KB of SRAM. The SAM D21 devices operate at a maximum frequency of 48MHz and reach 2.46 CoreMark/MHz. They are designed for simple and intuitive migration with identical peripheral modules, hex compatible code, identical linear address map and pin compatible migration paths between all devices in the product series. All devices include intelligent and flexible peripherals, Atmel Event System for inter-peripheral signaling, and support for capacitive touch button, slider and wheel user interfaces.; PROD_ID: IC-13064
U5-U8 = POWERSTEP01:POWERSTEP01: powerSTEP01 Series 5V 10A System-in-Package Integrating Microstepping Controller; AVAILABILITY: Unavailable; DESCRIPTION: powerSTEP01 Series 5V 10A System-in-Package Integrating Microstepping Controller; MF: STMicroelectronics; MP: POWERSTEP01; PACKAGE: PowerVFQFN-89 STMicroelectronics; PRICE: None
X1 = con-phoenix-508:MSTBA4: PHOENIX; MF: FARNELL; MPN: 1757268; OC_FARNELL: 3705195; OC_NEWARK: 71C4163
X2 = SmartPrj:CRYSTAL-3.2-2.5